# Altium schematic sheet Core.SchDoc
size A3; SheetNumber: 4; SheetTotal: 6
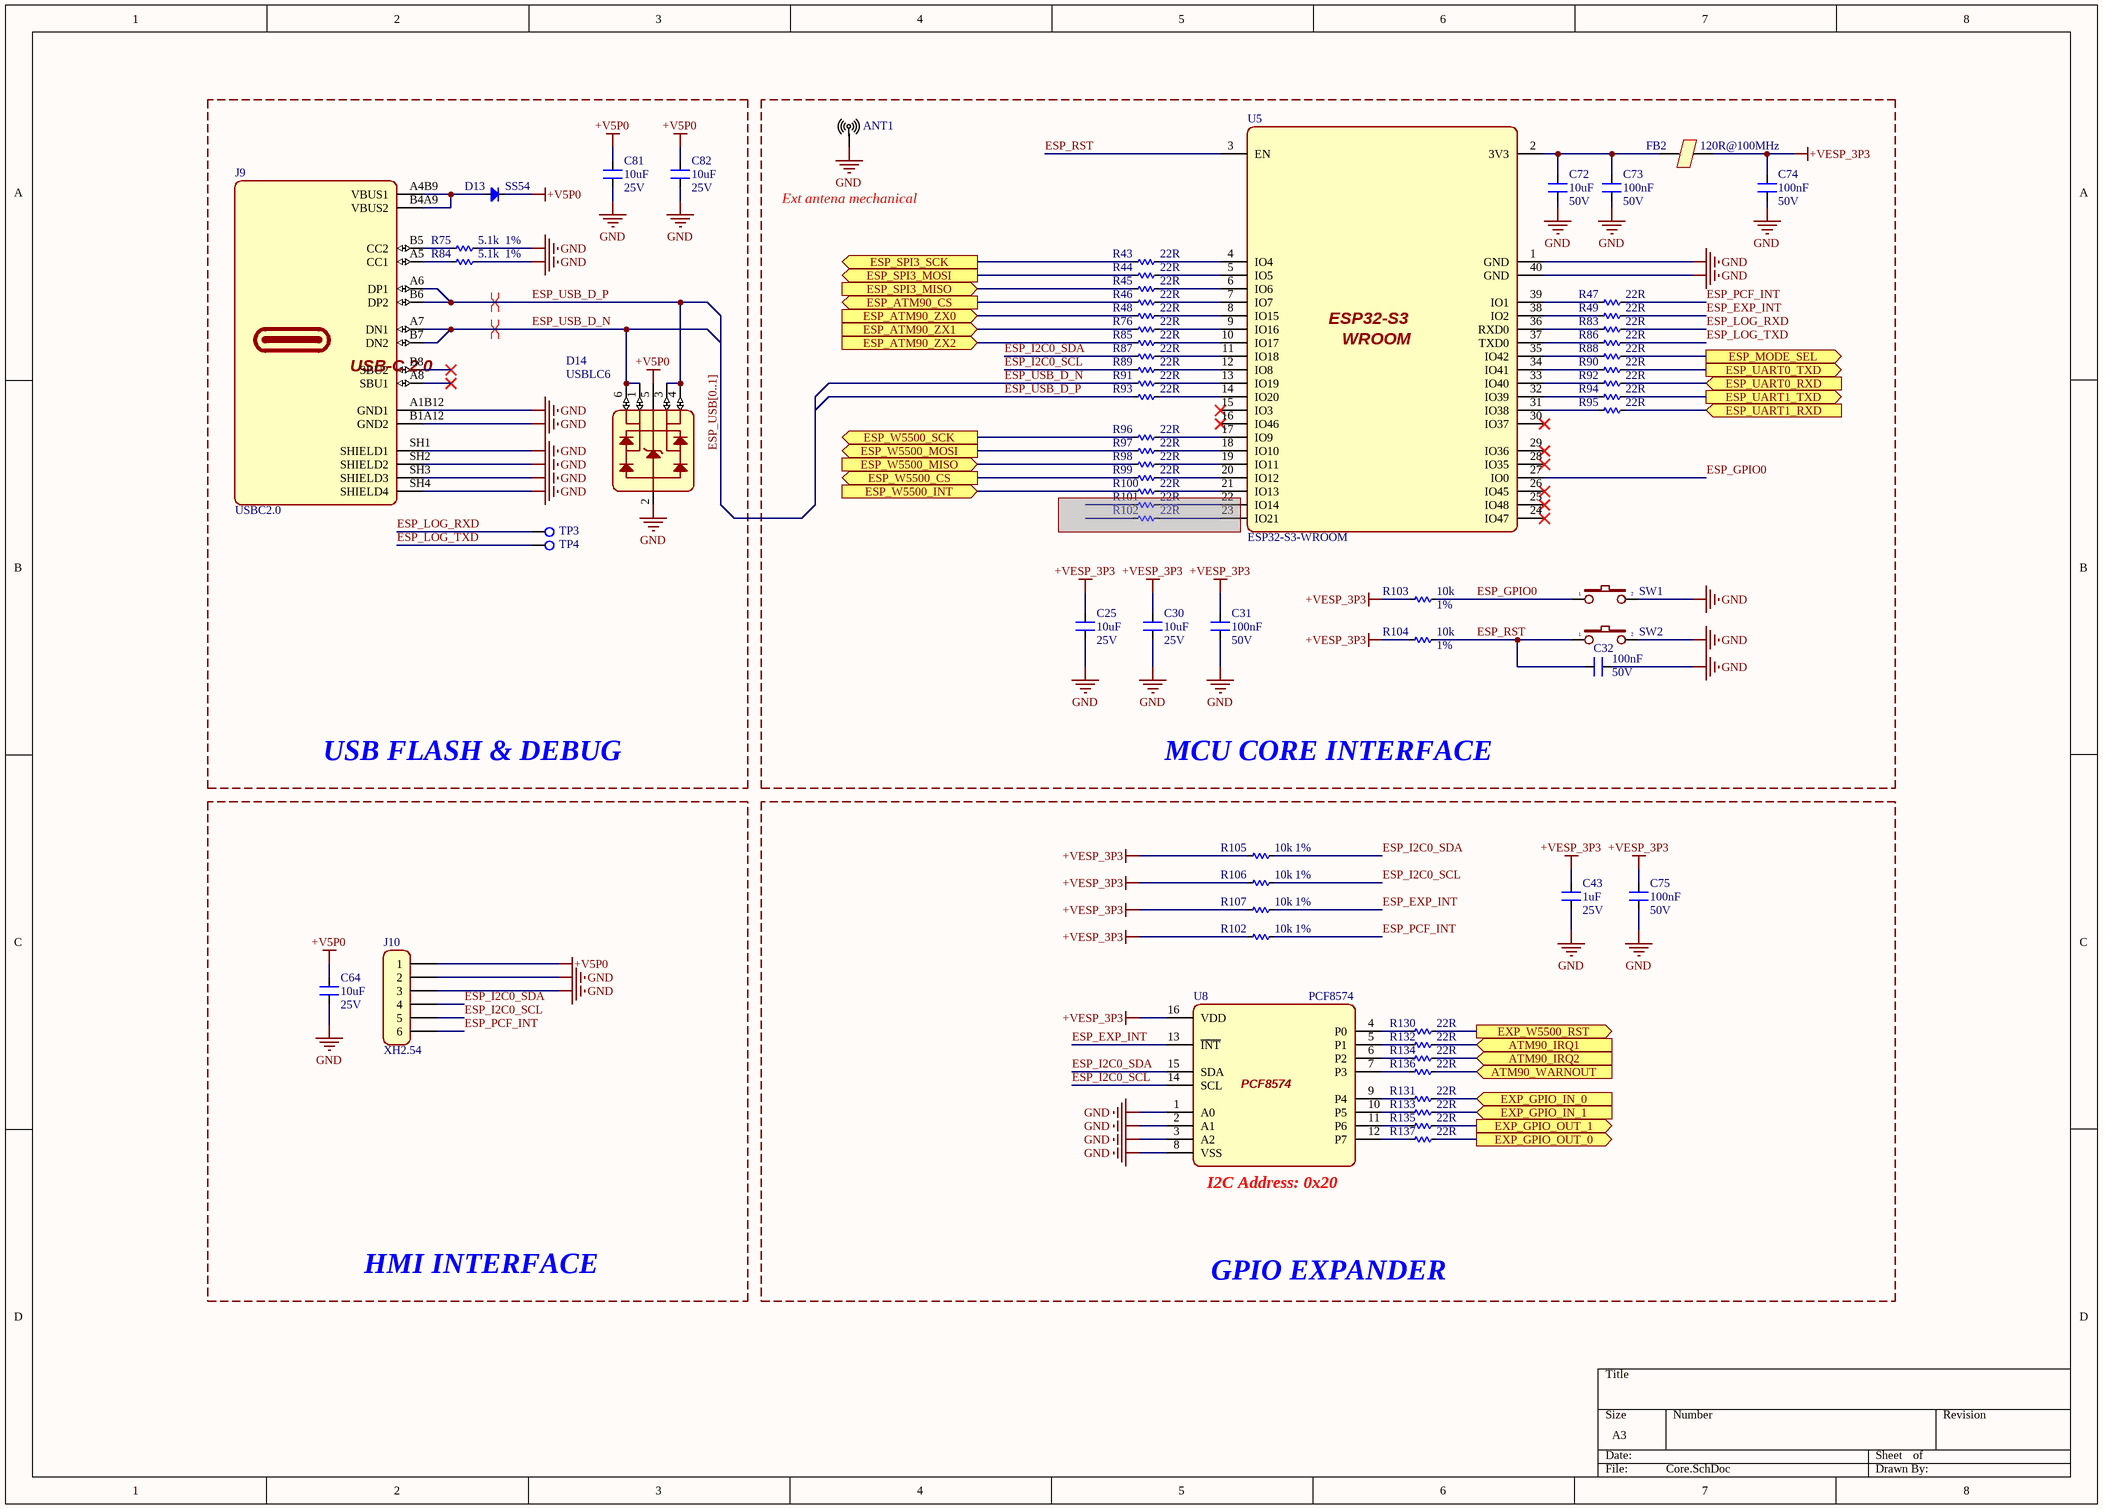
[diagram p0: Core.SchDoc]

## Parts
(Parts that share a designator on the sheet are numbered #1, #2 ... from top to bottom, then left to right.)
ANT1  Anten  [SMA-8.5mm]  (value not drawn)
C25  Rating: 25V  [CAP_SMD_0603]  (hidden comment: 10uF)
C30  Rating: 25V  [CAP_SMD_0603]  (hidden comment: 10uF)
C31  Rating: 50V  [CAP_SMD_0603]  (hidden comment: 100nF)
C32  Rating: 50V  [CAP_SMD_0603]  (hidden comment: 100nF)
C43  Rating: 25V  [CAP_SMD_0603]  (hidden comment: 1uF)
C64  Rating: 25V  [CAP_SMD_0603]  (hidden comment: 10uF)
C72  Rating: 50V  [CAP_SMD_0603]  (hidden comment: 10uF)
C73  Rating: 50V  [CAP_SMD_0603]  (hidden comment: 100nF)
C74  Rating: 50V  [CAP_SMD_0603]  (hidden comment: 100nF)
C75  Rating: 50V  [CAP_SMD_0603]  (hidden comment: 100nF)
C81  Rating: 25V  [CAP_SMD_0603]  (hidden comment: 10uF)
C82  Rating: 25V  [CAP_SMD_0603]  (hidden comment: 10uF)
D13  SS54  [DIO-SMD-A]
D14  USBLC6  [SOT23-6]
FB2  120R@100MHz  [FER 0805/2012]
J9  USBC2.0  [MOLEX-2171790001]
J10  XH2.54  [JP6-C1T]
R43  22R  [RES_SMD_0603]
R44  22R  [RES_SMD_0603]
R45  22R  [RES_SMD_0603]
R46  22R  [RES_SMD_0603]
R47  22R  [RES_SMD_0603]
R48  22R  [RES_SMD_0603]
R49  22R  [RES_SMD_0603]
R75  Tolerance: 1%  [RES_SMD_0603]  (hidden comment: 5.1k)
R76  22R  [RES_SMD_0603]
R83  22R  [RES_SMD_0603]
R84  Tolerance: 1%  [RES_SMD_0603]  (hidden comment: 5.1k)
R85  22R  [RES_SMD_0603]
R86  22R  [RES_SMD_0603]
R87  22R  [RES_SMD_0603]
R88  22R  [RES_SMD_0603]
R89  22R  [RES_SMD_0603]
R90  22R  [RES_SMD_0603]
R91  22R  [RES_SMD_0603]
R92  22R  [RES_SMD_0603]
R93  22R  [RES_SMD_0603]
R94  22R  [RES_SMD_0603]
R95  22R  [RES_SMD_0603]
R96  22R  [RES_SMD_0603]
R97  22R  [RES_SMD_0603]
R98  22R  [RES_SMD_0603]
R99  22R  [RES_SMD_0603]
R100  22R  [RES_SMD_0603]
R101  22R  [RES_SMD_0603]  (masked out: inside a compile mask, not in the netlist)
R102#1  22R  [RES_SMD_0603]  (masked out: inside a compile mask, not in the netlist)
R102#2  Tolerance: 1%  [RES_SMD_0603]  (hidden comment: 10k)
R103  Tolerance: 1%  [RES_SMD_0603]  (hidden comment: 10k)
R104  Tolerance: 1%  [RES_SMD_0603]  (hidden comment: 10k)
R105  Tolerance: 1%  [RES_SMD_0603]  (hidden comment: 10k)
R106  Tolerance: 1%  [RES_SMD_0603]  (hidden comment: 10k)
R107  Tolerance: 1%  [RES_SMD_0603]  (hidden comment: 10k)
R130  22R  [RES_SMD_0603]
R131  22R  [RES_SMD_0603]
R132  22R  [RES_SMD_0603]
R133  22R  [RES_SMD_0603]
R134  22R  [RES_SMD_0603]
R135  22R  [RES_SMD_0603]
R136  22R  [RES_SMD_0603]
R137  22R  [RES_SMD_0603]
SW1  SW2  [SW1-SMD]  (value not drawn)
SW2  SW2  [SW1-SMD]  (value not drawn)
TP3  Test_Point  [PAD-SMD-D2.0]  (value not drawn)
TP4  Test_Point  [PAD-SMD-D2.0]  (value not drawn)
U5  ESP32-S3-WROOM  [ESP32-S3-WROOM-1-N16R8]
U8  PCF8574  [SOIC-16-300mil]

## Blocks framed on the sheet
USB FLASH & DEBUG: C81 C82 D13 D14 J9 R75 R84 TP3 TP4
MCU CORE INTERFACE: ANT1 C25 C30-C32 C72-C74 FB2 R43-R49 R76 R83 R85-R101 R102#1 R103 R104 SW1 SW2 U5
HMI INTERFACE: C64 J10
GPIO EXPANDER: C43 C75 R102#2 R105-R107 R130-R137 U8

## Ports
ATM90_IRQ1 (in, see Architecture[4B]), ATM90_IRQ2 (in, see Architecture[4B]), ATM90_WARNOUT (in, see Architecture[4B]), ESP_ATM90_CS (out, see Architecture[4A]), ESP_ATM90_ZX0 (in, see Architecture[4B]), ESP_ATM90_ZX1 (in, see Architecture[4B]), ESP_ATM90_ZX2 (in, see Architecture[4B]), ESP_MODE_SEL (out, see Architecture[4A]), ESP_SPI3_MISO (in, see Architecture[4A]), ESP_SPI3_MOSI (out, see Architecture[4A]), ESP_SPI3_SCK (out, see Architecture[4A]), ESP_UART0_RXD (in, see Architecture[6B]), ESP_UART0_TXD (out, see Architecture[6B]), ESP_UART1_RXD (in, see Architecture[6B]), ESP_UART1_TXD (out, see Architecture[6B]), ESP_W5500_CS (out, see Architecture[6A]), ESP_W5500_INT (in, see Architecture[6A]), ESP_W5500_MISO (in, see Architecture[6A]), ESP_W5500_MOSI (out, see Architecture[6A]), ESP_W5500_SCK (out, see Architecture[6A]), EXP_GPIO_IN_0 (in, see Architecture[6B]), EXP_GPIO_IN_1 (in, see Architecture[6B]), EXP_GPIO_OUT_0 (out, see Architecture[6B]), EXP_GPIO_OUT_1 (out, see Architecture[6B]), EXP_W5500_RST (out, see Architecture[6A])

## Nets
+V5P0: C64.1 C81.1 C82.1 D13.2(K) D14.5(VBUS) J10.1
+VESP_3P3: C25.1 C30.1 C31.1 C43.1 C74.1 C75.1 FB2.2 R102#2.1 R103.1 R104.1 R105.1 R106.1 R107.1 U8.16(VDD)
GND: ANT1.GND C25.2 C30.2 C31.2 C32.1 C43.2 C64.2 C72.2 C73.2 C74.2 C75.2 C81.2 C82.2 D14.2(GND) J9.A1B12(GND1) J9.B1A12(GND2) J9.SH1(SHIELD1) J9.SH2(SHIELD2) J9.SH3(SHIELD3) J9.SH4(SHIELD4) J10.2 J10.3 R75.2 R84.2 SW1.2 SW2.2 U5.1(GND) U5.40(GND) U8.1(A0) U8.2(A1) U8.3(A2) U8.8(VSS)
ATM90_IRQ1: R132.1 ; port ATM90_IRQ1
ATM90_IRQ2: R134.1 ; port ATM90_IRQ2
ATM90_WARNOUT: R136.1 ; port ATM90_WARNOUT
ESP_ATM90_CS: R46.2 ; port ESP_ATM90_CS
ESP_ATM90_ZX0: R48.2 ; port ESP_ATM90_ZX0
ESP_ATM90_ZX1: R76.2 ; port ESP_ATM90_ZX1
ESP_ATM90_ZX2: R85.2 ; port ESP_ATM90_ZX2
ESP_EXP_INT: R49.1 R107.2 U8.13(~{INT})
ESP_GPIO0: R103.2 SW1.1 U5.27(IO0)
ESP_I2C0_SCL: J10.5 R89.2 R106.2 U8.14(SCL)
ESP_I2C0_SDA: J10.4 R87.2 R105.2 U8.15(SDA)
ESP_LOG_RXD: R83.1 TP3.1
ESP_LOG_TXD: R86.1 TP4.1
ESP_MODE_SEL: R88.1 ; port ESP_MODE_SEL
ESP_PCF_INT: J10.6 R47.1 R102#2.2
ESP_RST: C32.2 R104.2 SW2.1 U5.3(EN)
ESP_SPI3_MISO: R45.2 ; port ESP_SPI3_MISO
ESP_SPI3_MOSI: R44.2 ; port ESP_SPI3_MOSI
ESP_SPI3_SCK: R43.2 ; port ESP_SPI3_SCK
ESP_UART0_RXD: R92.1 ; port ESP_UART0_RXD
ESP_UART0_TXD: R90.1 ; port ESP_UART0_TXD
ESP_UART1_RXD: R95.1 ; port ESP_UART1_RXD
ESP_UART1_TXD: R94.1 ; port ESP_UART1_TXD
ESP_USB_D_N: D14.1(I/O1_IN) D14.6(I/O1_OUT) J9.A7(DN1) J9.B7(DN2) R91.2
ESP_USB_D_P: D14.3(I/O2_IN) D14.4(I/O2_OUT) J9.A6(DP1) J9.B6(DP2) R93.2
ESP_W5500_CS: R99.2 ; port ESP_W5500_CS
ESP_W5500_INT: R100.2 ; port ESP_W5500_INT
ESP_W5500_MISO: R98.2 ; port ESP_W5500_MISO
ESP_W5500_MOSI: R97.2 ; port ESP_W5500_MOSI
ESP_W5500_SCK: R96.2 ; port ESP_W5500_SCK
EXP_GPIO_IN_0: R131.1 ; port EXP_GPIO_IN_0
EXP_GPIO_IN_1: R133.1 ; port EXP_GPIO_IN_1
EXP_GPIO_OUT_0: R137.1 ; port EXP_GPIO_OUT_0
EXP_GPIO_OUT_1: R135.1 ; port EXP_GPIO_OUT_1
EXP_W5500_RST: R130.1 ; port EXP_W5500_RST
NetC72_1: C72.1 C73.1 FB2.1 U5.2(3V3)
NetD13_1: D13.1(A) J9.A4B9(VBUS1) J9.B4A9(VBUS2)
NetJ9_A5: J9.A5(CC1) R84.1
NetJ9_B5: J9.B5(CC2) R75.1
NetR43_1: R43.1 U5.4(IO4)
NetR44_1: R44.1 U5.5(IO5)
NetR45_1: R45.1 U5.6(IO6)
NetR46_1: R46.1 U5.7(IO7)
NetR47_2: R47.2 U5.39(IO1)
NetR48_1: R48.1 U5.8(IO15)
NetR49_2: R49.2 U5.38(IO2)
NetR76_1: R76.1 U5.9(IO16)
NetR83_2: R83.2 U5.36(RXD0)
NetR85_1: R85.1 U5.10(IO17)
NetR86_2: R86.2 U5.37(TXD0)
NetR87_1: R87.1 U5.11(IO18)
NetR88_2: R88.2 U5.35(IO42)
NetR89_1: R89.1 U5.12(IO8)
NetR90_2: R90.2 U5.34(IO41)
NetR91_1: R91.1 U5.13(IO19)
NetR92_2: R92.2 U5.33(IO40)
NetR93_1: R93.1 U5.14(IO20)
NetR94_2: R94.2 U5.32(IO39)
NetR95_2: R95.2 U5.31(IO38)
NetR96_1: R96.1 U5.17(IO9)
NetR97_1: R97.1 U5.18(IO10)
NetR98_1: R98.1 U5.19(IO11)
NetR99_1: R99.1 U5.20(IO12)
NetR100_1: R100.1 U5.21(IO13)
NetR130_2: R130.2 U8.4(P0)
NetR131_2: R131.2 U8.9(P4)
NetR132_2: R132.2 U8.5(P1)
NetR133_2: R133.2 U8.10(P5)
NetR134_2: R134.2 U8.6(P2)
NetR135_2: R135.2 U8.11(P6)
NetR136_2: R136.2 U8.7(P3)
NetR137_2: R137.2 U8.12(P7)

Not connected (* = marked no-connect by the designer): J9 A8(SBU1)* B8(SBU2)*; U5 15(IO3)* 16(IO46)* 22(IO14) 23(IO21) 24(IO47)* 25(IO48)* 26(IO45)* 28(IO35)* 29(IO36)* 30(IO37)*

## Buses and harness runs
bus ESP_USB[0..1]

## Layout directives
differential pair; differential pair class USB 90R: ESP_USB_D_N, ESP_USB_D_P

## Notes on the sheet
- Ext antena mechanical
- (near U8) I2C Address: 0x20
- (in symbol ESP32-S3-WROOM) ESP32-S3; WROOM
- (in symbol USBC-2.0) USB-C 2.0

## Library data of the parts
ANT1 = Anten Mechanical
C25 C30-C32 C43 C64 C72-C75 C81 C82 = CN: PN: *; LCSC: *
  C25 C30 C64 C72 C81 C82: Value: 10uF
  C31 C32 C73-C75: Value: 100nF
  C43: Value: 1uF
D13 = Diode SMD: Default Diode; LCSC: C22452; PN: SS54; Value: SS54
D14 = USBLC6: TVS DIODE 5.25VWM 17VC SOT23-6
FB2 = FERRITE BEAD: PN: CBW201209U121T; LCSC: C139186; Value: 120R@100MHz
J9 = USBC-2.0: USB Type C - Connector, Top-mount SMT, 16pos | Molex Incorporated 217179-0001; PN: 2171790001; LCSC: C3197684; Value: USBC2.0
J10 = JP6: ComponentLink1 Description: Manufacturer; ComponentLink2 Description: Datasheet; ComponentLink1URL: http://www.we-online.com; ComponentLink2URL: http://katalog.we-online.de/em/datasheet/6130xx143121.pdf; PN: *; LCSC: *; Value: XH2.54
R43-R49 R76 R83 R85-R101 R102#1 R130-R137 = Res-SMD: Resistor; Tolerance: 1%; PN: *; LCSC: *; Value: 22R
R75 R84 R102#2 R103-R107 = Res-SMD: Resistor; PN: *; LCSC: *
  R75 R84: Value: 5.1k
  R102#2 R103-R107: Value: 10k
SW1 SW2 = SW2: Switch button 2 pin; PN: B3U-3000P; LCSC: C963349; Value: SW2
U5 = ESP32-S3-WROOM: -103.5dBm -40℃~+65℃ 2.4GHz 20.5dBm 355mA 3V~3.6V 95mA ESP32-S3R8 On-board PCB Antenna UART、SPI、I2C、GPIO、I2S、USB SMD,25.5x18mm WiFi Modules ROHS; LCSC: C2913202; PN: ESP32-S3-WROOM-1-N16R8; Value: ESP32-S3-WROOM
U8 = PCF8574: -40℃~+85℃ 100kHz 10mA 16 2.5V~6V 2.5uA 30uA 8 I2C Interrupt Output Reset function、Cascading and address extension、Built-in LED driver SOIC-16-300mil I/O Expanders ROHS; PN: PCF8574T/3,518; LCSC: C7605; Value: PCF8574